# EAGLE design powerboard1_2 (EAGLE 8.1.1)
DRAWING_TITLE: POWER_BOARD; REVISION: 1.1
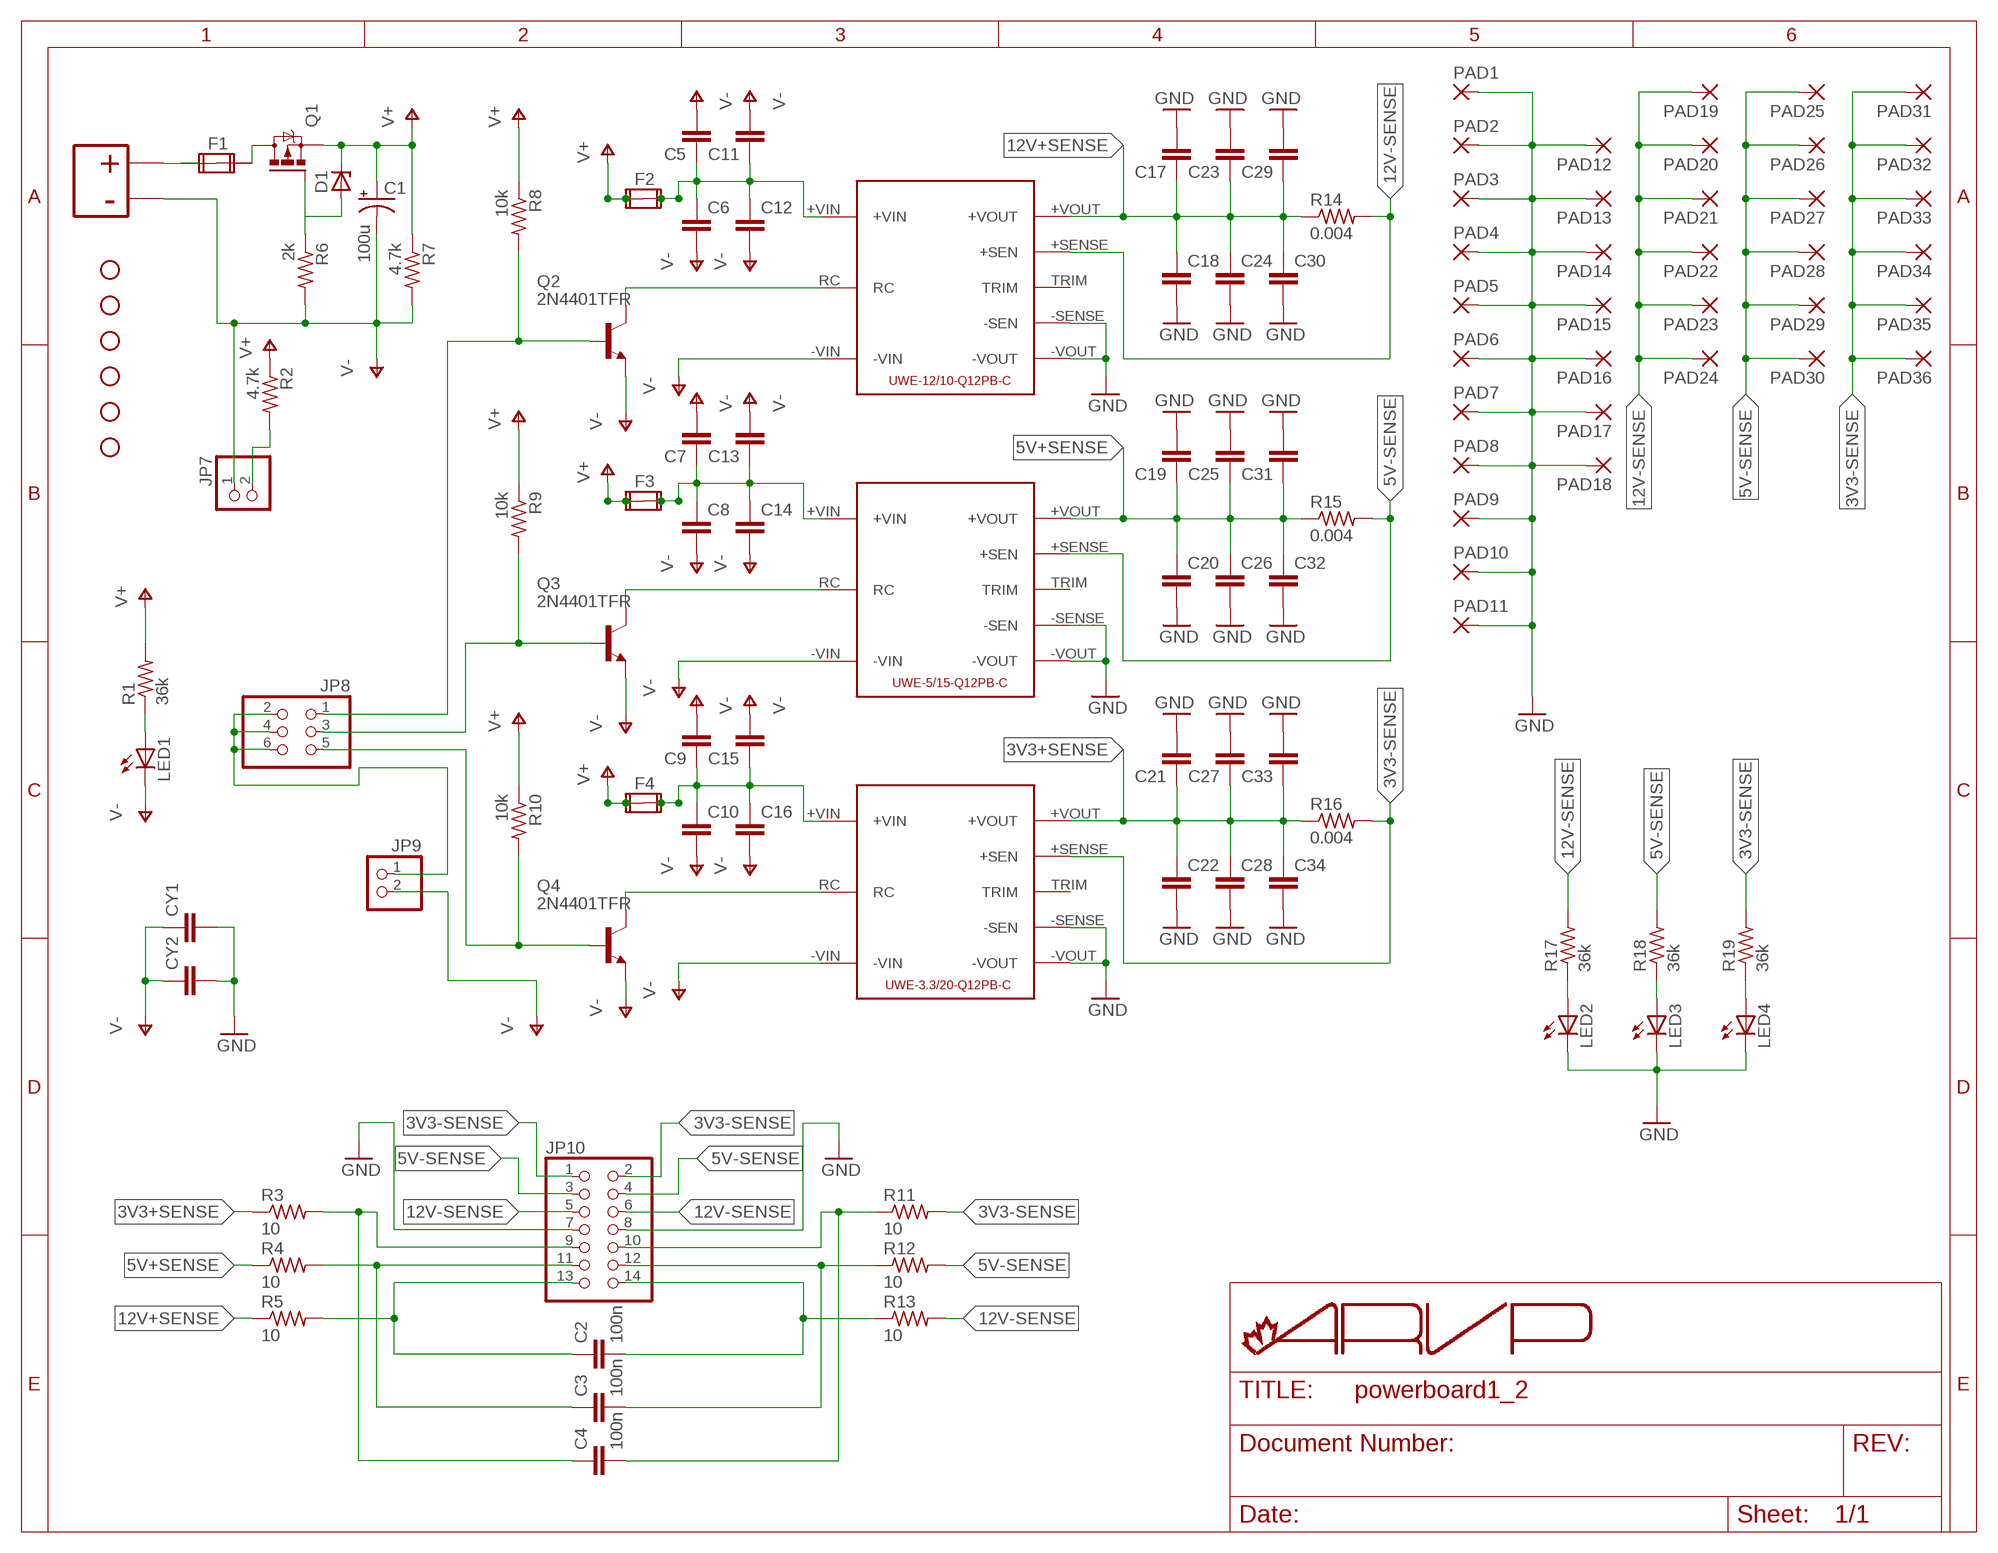
[diagram p0: schematic, sheet 1]

## Parts
C1  100u  CPOL-USE3.5-8  [E3,5-8]
C2  100n  C-EU025-024X044  [C025-024X044]
C3  100n  C-EU025-024X044  [C025-024X044]
C4  100n  C-EU025-024X044  [C025-024X044]
C5  C-EU050-035X075  [C050-035X075]
C6  C-EU050-035X075  [C050-035X075]
C7  C-EU050-035X075  [C050-035X075]
C8  C-EU050-035X075  [C050-035X075]
C9  C-EU050-035X075  [C050-035X075]
C10  C-EU050-035X075  [C050-035X075]
C11  C-EU050-035X075  [C050-035X075]
C12  C-EU050-035X075  [C050-035X075]
C13  C-EU050-035X075  [C050-035X075]
C14  C-EU050-035X075  [C050-035X075]
C15  C-EU050-035X075  [C050-035X075]
C16  C-EU050-035X075  [C050-035X075]
C17  C-EU025-040X050  [C025-040X050]
C18  C-EU025-040X050  [C025-040X050]
C19  C-EU025-040X050  [C025-040X050]
C20  C-EU025-040X050  [C025-040X050]
C21  C-EU025-040X050  [C025-040X050]
C22  C-EU025-040X050  [C025-040X050]
C23  C-EU025-040X050  [C025-040X050]
C24  C-EU025-040X050  [C025-040X050]
C25  C-EU025-040X050  [C025-040X050]
C26  C-EU025-040X050  [C025-040X050]
C27  C-EU025-040X050  [C025-040X050]
C28  C-EU025-040X050  [C025-040X050]
C29  C-EU025-040X050  [C025-040X050]
C30  C-EU025-040X050  [C025-040X050]
C31  C-EU025-040X050  [C025-040X050]
C32  C-EU025-040X050  [C025-040X050]
C33  C-EU025-040X050  [C025-040X050]
C34  C-EU025-040X050  [C025-040X050]
CY1  CYYC7B5  [YC7B5]
CY2  CYYC7B5  [YC7B5]
D1  BZV10  [DO34Z7]
F1  FUSE2P  [FUSE1]
F2  FUSE2P  [FUSE1]
F3  FUSE2P  [FUSE1]
F4  FUSE2P  [FUSE1]
JP1  STAND-OFF  [STAND-OFF]
JP2  STAND-OFF  [STAND-OFF]
JP3  STAND-OFF  [STAND-OFF]
JP4  STAND-OFF  [STAND-OFF]
JP5  STAND-OFF  [STAND-OFF]
JP6  STAND-OFF  [STAND-OFF]
JP7  PINHD-1X2/90  [1X02/90]
JP8  PINHD-2X3/90  [2X03/90]
JP9  PINHD-1X2/90  [1X02/90]
JP10  PINHD-2X7  [2X07]
LED1  LED3MM  [LED3MM]
LED2  LED3MM  [LED3MM]
LED3  LED3MM  [LED3MM]
LED4  LED3MM  [LED3MM]
PAD1  WIREPAD3,17/1,3  [3,17/1,3]
PAD2  WIREPAD3,17/1,3  [3,17/1,3]
PAD3  WIREPAD3,17/1,3  [3,17/1,3]
PAD4  WIREPAD3,17/1,3  [3,17/1,3]
PAD5  WIREPAD3,17/1,3  [3,17/1,3]
PAD6  WIREPAD3,17/1,3  [3,17/1,3]
PAD7  WIREPAD3,17/1,3  [3,17/1,3]
PAD8  WIREPAD3,17/1,3  [3,17/1,3]
PAD9  WIREPAD3,17/1,3  [3,17/1,3]
PAD10  WIREPAD3,17/1,3  [3,17/1,3]
PAD11  WIREPAD3,17/1,3  [3,17/1,3]
PAD12  WIREPAD3,17/1,3  [3,17/1,3]
PAD13  WIREPAD3,17/1,3  [3,17/1,3]
PAD14  WIREPAD3,17/1,3  [3,17/1,3]
PAD15  WIREPAD3,17/1,3  [3,17/1,3]
PAD16  WIREPAD3,17/1,3  [3,17/1,3]
PAD17  WIREPAD3,17/1,3  [3,17/1,3]
PAD18  WIREPAD3,17/1,3  [3,17/1,3]
PAD19  WIREPAD3,17/1,3  [3,17/1,3]
PAD20  WIREPAD3,17/1,3  [3,17/1,3]
PAD21  WIREPAD3,17/1,3  [3,17/1,3]
PAD22  WIREPAD3,17/1,3  [3,17/1,3]
PAD23  WIREPAD3,17/1,3  [3,17/1,3]
PAD24  WIREPAD3,17/1,3  [3,17/1,3]
PAD25  WIREPAD3,17/1,3  [3,17/1,3]
PAD26  WIREPAD3,17/1,3  [3,17/1,3]
PAD27  WIREPAD3,17/1,3  [3,17/1,3]
PAD28  WIREPAD3,17/1,3  [3,17/1,3]
PAD29  WIREPAD3,17/1,3  [3,17/1,3]
PAD30  WIREPAD3,17/1,3  [3,17/1,3]
PAD31  WIREPAD3,17/1,3  [3,17/1,3]
PAD32  WIREPAD3,17/1,3  [3,17/1,3]
PAD33  WIREPAD3,17/1,3  [3,17/1,3]
PAD34  WIREPAD3,17/1,3  [3,17/1,3]
PAD35  WIREPAD3,17/1,3  [3,17/1,3]
PAD36  WIREPAD3,17/1,3  [3,17/1,3]
Q1  IPP80P03P4L04AKSA1  [TO220BV]
Q2  2N4401TFR  [TO92-EBC]
Q3  2N4401TFR  [TO92-EBC]
Q4  2N4401TFR  [TO92-EBC]
R1  36k  R-US_0204/7  [0204/7]
R2  4.7k  R-US_0204/7  [0204/7]
R3  10  R-US_0204/5  [0204/5]
R4  10  R-US_0204/5  [0204/5]
R5  10  R-US_0204/5  [0204/5]
R6  2k  R-US_0204/7  [0204/7]
R7  4.7k  R-US_0204/7  [0204/7]
R8  10k  R-US_0204/7  [0204/7]
R9  10k  R-US_0204/7  [0204/7]
R10  10k  R-US_0204/7  [0204/7]
R11  10  R-US_0204/5  [0204/5]
R12  10  R-US_0204/5  [0204/5]
R13  10  R-US_0204/5  [0204/5]
R14  0.004  R-US_0617/22  [0617/22]
R15  0.004  R-US_0617/22  [0617/22]
R16  0.004  R-US_0617/22  [0617/22]
R17  36k  R-US_0204/7  [0204/7]
R18  36k  R-US_0204/7  [0204/7]
R19  36k  R-US_0204/7  [0204/7]
T1  2_POS_TERMINAL  [PHOENIX_CONTACT_MKDS_5/2-7.62]
U1  UWE-12/10-Q12PB-C  [UWE-100-120W]
U2  UWE-5/15-Q12PB-C  [UWE-100-120W]
U3  UWE-3.3/20-Q12PB-C  [UWE-100-120W]

## Nets
3V3+SENSE: C21.1 C22.1 C27.1 C28.1 C33.1 C34.1 R3.1 R16.1 U3.+VOUT
3V3-SENSE: JP10.1 JP10.2 PAD31.1(P) PAD32.1(P) PAD33.1(P) PAD34.1(P) PAD35.1(P) PAD36.1(P) R11.2 R16.2 R19.2 U3.+SENSE(+SEN)
5V+SENSE: C19.1 C20.1 C25.1 C26.1 C31.1 C32.1 R4.1 R15.1 U2.+VOUT
5V-SENSE: JP10.3 JP10.4 PAD25.1(P) PAD26.1(P) PAD27.1(P) PAD28.1(P) PAD29.1(P) PAD30.1(P) R12.2 R15.2 R18.2 U2.+SENSE(+SEN)
12V+SENSE: C17.1 C18.1 C23.1 C24.1 C29.1 C30.1 R5.1 R14.1 U1.+VOUT
12V-SENSE: JP10.5 JP10.6 PAD19.1(P) PAD20.1(P) PAD21.1(P) PAD22.1(P) PAD23.1(P) PAD24.1(P) R13.2 R14.2 R17.2 U1.+SENSE(+SEN)
ENABLE_3V3: Q4.C U3.RC
ENABLE_5V: Q3.C U2.RC
ENABLE_12V: Q2.C U1.RC
GND [ouputGroundPlane]: C17.2 C18.2 C19.2 C20.2 C21.2 C22.2 C23.2 C24.2 C25.2 C26.2 C27.2 C28.2 C29.2 C30.2 C31.2 C32.2 C33.2 C34.2 CY1.2 CY2.2 JP10.7 JP10.8 LED2.K(C) LED3.K(C) LED4.K(C) PAD1.1(P) PAD2.1(P) PAD3.1(P) PAD4.1(P) PAD5.1(P) PAD6.1(P) PAD7.1(P) PAD8.1(P) PAD9.1(P) PAD10.1(P) PAD11.1(P) PAD12.1(P) PAD13.1(P) PAD14.1(P) PAD15.1(P) PAD16.1(P) PAD17.1(P) PAD18.1(P) U1.-SENSE(-SEN) U1.-VOUT U2.-SENSE(-SEN) U2.-VOUT U3.-SENSE(-SEN) U3.-VOUT
J3: C4.1 JP10.9 R3.2
J4: C4.2 JP10.10 R11.1
J5: C3.1 JP10.11 R4.2
J6: C3.2 JP10.12 R12.1
J7: C2.1 JP10.13 R5.2
J8: C2.2 JP10.14 R13.1
N$1: LED1.A R1.1
N$2: JP7.2 R2.2
N$3: F1.1A F1.1B T1.P$1
N$4: D1.A Q1.G R6.1
N$5: C5.1 C6.1 C11.1 C12.1 F2.2A F2.2B U1.+VIN
N$7: C7.1 C8.1 C13.1 C14.1 F3.2A F3.2B U2.+VIN
N$8 [ouputGroundPlane]: JP8.2 JP8.4 JP8.6 JP9.1
N$9: LED2.A R17.1
N$10: LED3.A R18.1
N$11: LED4.A R19.1
N$12: C9.1 C10.1 C15.1 C16.1 F4.2A F4.2B U3.+VIN
ON/OFF_1 [inputGroundPlane]: JP8.1 Q2.B R8.2
ON/OFF_2 [inputGroundPlane]: JP8.3 Q3.B R9.2
ON/OFF_3 [inputGroundPlane]: JP8.5 Q4.B R10.2
V+: C1.+ D1.C F2.1A F2.1B F3.1A F3.1B F4.1A F4.1B Q1.S R1.2 R2.1 R7.1 R8.1 R9.1 R10.1
V- [ouputGroundPlane]: C1.- C5.2 C6.2 C7.2 C8.2 C9.2 C10.2 C11.2 C12.2 C13.2 C14.2 C15.2 C16.2 CY1.1 CY2.1 JP7.1 JP9.2 LED1.K(C) Q2.E Q3.E Q4.E R6.2 R7.2 T1.P$2 U1.-VIN U2.-VIN U3.-VIN
VBAT+: F1.2A F1.2B Q1.D
Unconnected: U1.TRIM U2.TRIM U3.TRIM

## Library data of the parts
C1 = rcl:CPOL-US: POLARIZED CAPACITOR, American symbol
C2-C34 = rcl:C-EU: CAPACITOR, European symbol
CY1 CY2 = rcl:CY: Y CAPACITOR for power line
D1 = diode:BZV10: Z DIODE
F1-F4 = special:FUSE2P: FUSE 5 x 20 mm
JP1-JP6 = SparkFun:STAND-OFF: Stand Off This is the mechanical footprint for a #4 phillips button head screw. Use the keepout ring to avoid running the screw head into surrounding components. SKU : PRT-00447
JP7 JP9 = pinhead:PINHD-1X2: PIN HEADER
JP8 = pinhead:PINHD-2X3: PIN HEADER
JP10 = pinhead:PINHD-2X7: PIN HEADER
LED1-LED4 = led:LED: LED OSRAM: - CHIPLED LG R971, LG N971, LY N971, LG Q971, LY Q971, LO R971, LY R971 LH N974, LH R974 LS Q976, LO Q976, LY Q976 LO Q996 - Hyper CHIPLED LW Q18S LB Q993, LB Q99A, LB R99A - SideLED LS A670, LO A670, LY A670, LG A670, LP A670 LB A673, LV A673, LT A673, LW A673 LH A674 LY A675 LS A676, LA A676, LO A676, LY A676, LW A676 LS A679, LY A679, LG A679 - Hyper Micro SIDELED® LS Y876, LA Y876, LO Y876, LY Y876 LT Y87S - SmartLED LW L88C, LW L88S LB L89C, LB L89S, LG L890 LS L89K, LO L89K, LY L89K LS L896, LA L896, LO L896, LY L896 - TOPLED LS T670, LO T670, LY T670, LG T670, LP T670 LSG T670, LSP T670, LSY T670, LOP T670, LYG T670 LG T671, LOG T671, LSG T671 LB T673, LV T673, LT T673, LW T673 LH T674 LS T676, LA T676, LO T676, LY T676, LB T676, LH T676, LSB T676, LW T676 LB T67C, LV T67C, LT T67C, LS T67K, LO T67K, LY T67K, LW E67C LS E67B, LA E67B, LO E67B, LY E67B, LB E67C, LV E67C, LT E67C LW T67C LS T679, LY T679, LG T679 LS T770, LO T770, LY T770, LG T770, LP T770 LB T773, LV T773, LT T773, LW T773 LH T774 LS E675, LA E675, LY E675, LS T675 LS T776, LA T776, LO T776, LY T776, LB T776 LHGB T686 LT T68C, LB T68C - Hyper Mini TOPLED® LB M676 - Mini TOPLED Santana® LG M470 LS M47K, LO M47K, LY M47K Source: http://www.osram.convergy.de LUXEON: - LUMILED® LXK2-PW12-R00, LXK2-PW12-S00, LXK2-PW14-U00, LXK2-PW14-V00 LXK2-PM12-R00, LXK2-PM12-S00, LXK2-PM14-U00 LXK2-PE12-Q00, LXK2-PE12-R00, LXK2-PE12-S00, LXK2-PE14-T00, LXK2-PE14-U00 LXK2-PB12-K00, LXK2-PB12-L00, LXK2-PB12-M00, LXK2-PB14-N00, LXK2-PB14-P00, LXK2-PB14-Q00 LXK2-PR12-L00, LXK2-PR12-M00, LXK2-PR14-Q00, LXK2-PR14-R00 LXK2-PD12-Q00, LXK2-PD12-R00, LXK2-PD12-S00 LXK2-PH12-R00, LXK2-PH12-S00 LXK2-PL12-P00, LXK2-PL12-Q00, LXK2-PL12-R00 Source: www.luxeon.com KINGBRIGHT: KA-3528ASYC Source: www.kingbright.com
PAD1-PAD36 = wirepad:WIREPAD: Wire PAD connect wire on PCB
Q1 = transistor-power:IPP80P03P4L04AKSA1: P-CHANNEL MOS-FET SYMBOL
Q2-Q4 = New Power Board Library:2N4401TFR: NPN Transistor
R1 R2 R6-R10 R17-R19 = resistor:R-US_: RESISTOR, American symbol
R3-R5 R11-R16 = rcl:R-US_: RESISTOR, American symbol
T1 = New Power Board Library:2_POS_TERMINAL
U1 = New Power Board Library:UWE-12/10-Q12PB-C
U2 = New Power Board Library:UWE-5/15-Q12PB-C
U3 = New Power Board Library:UWE-3.3/20-Q12PB-C

## Net classes
0 default: clearance 0.205 mm
1 ouputGroundPlane: clearance 0.205 mm to class 0, clearance 1 mm
2 inputGroundPlane: clearance 0.205 mm to class 1

## Board
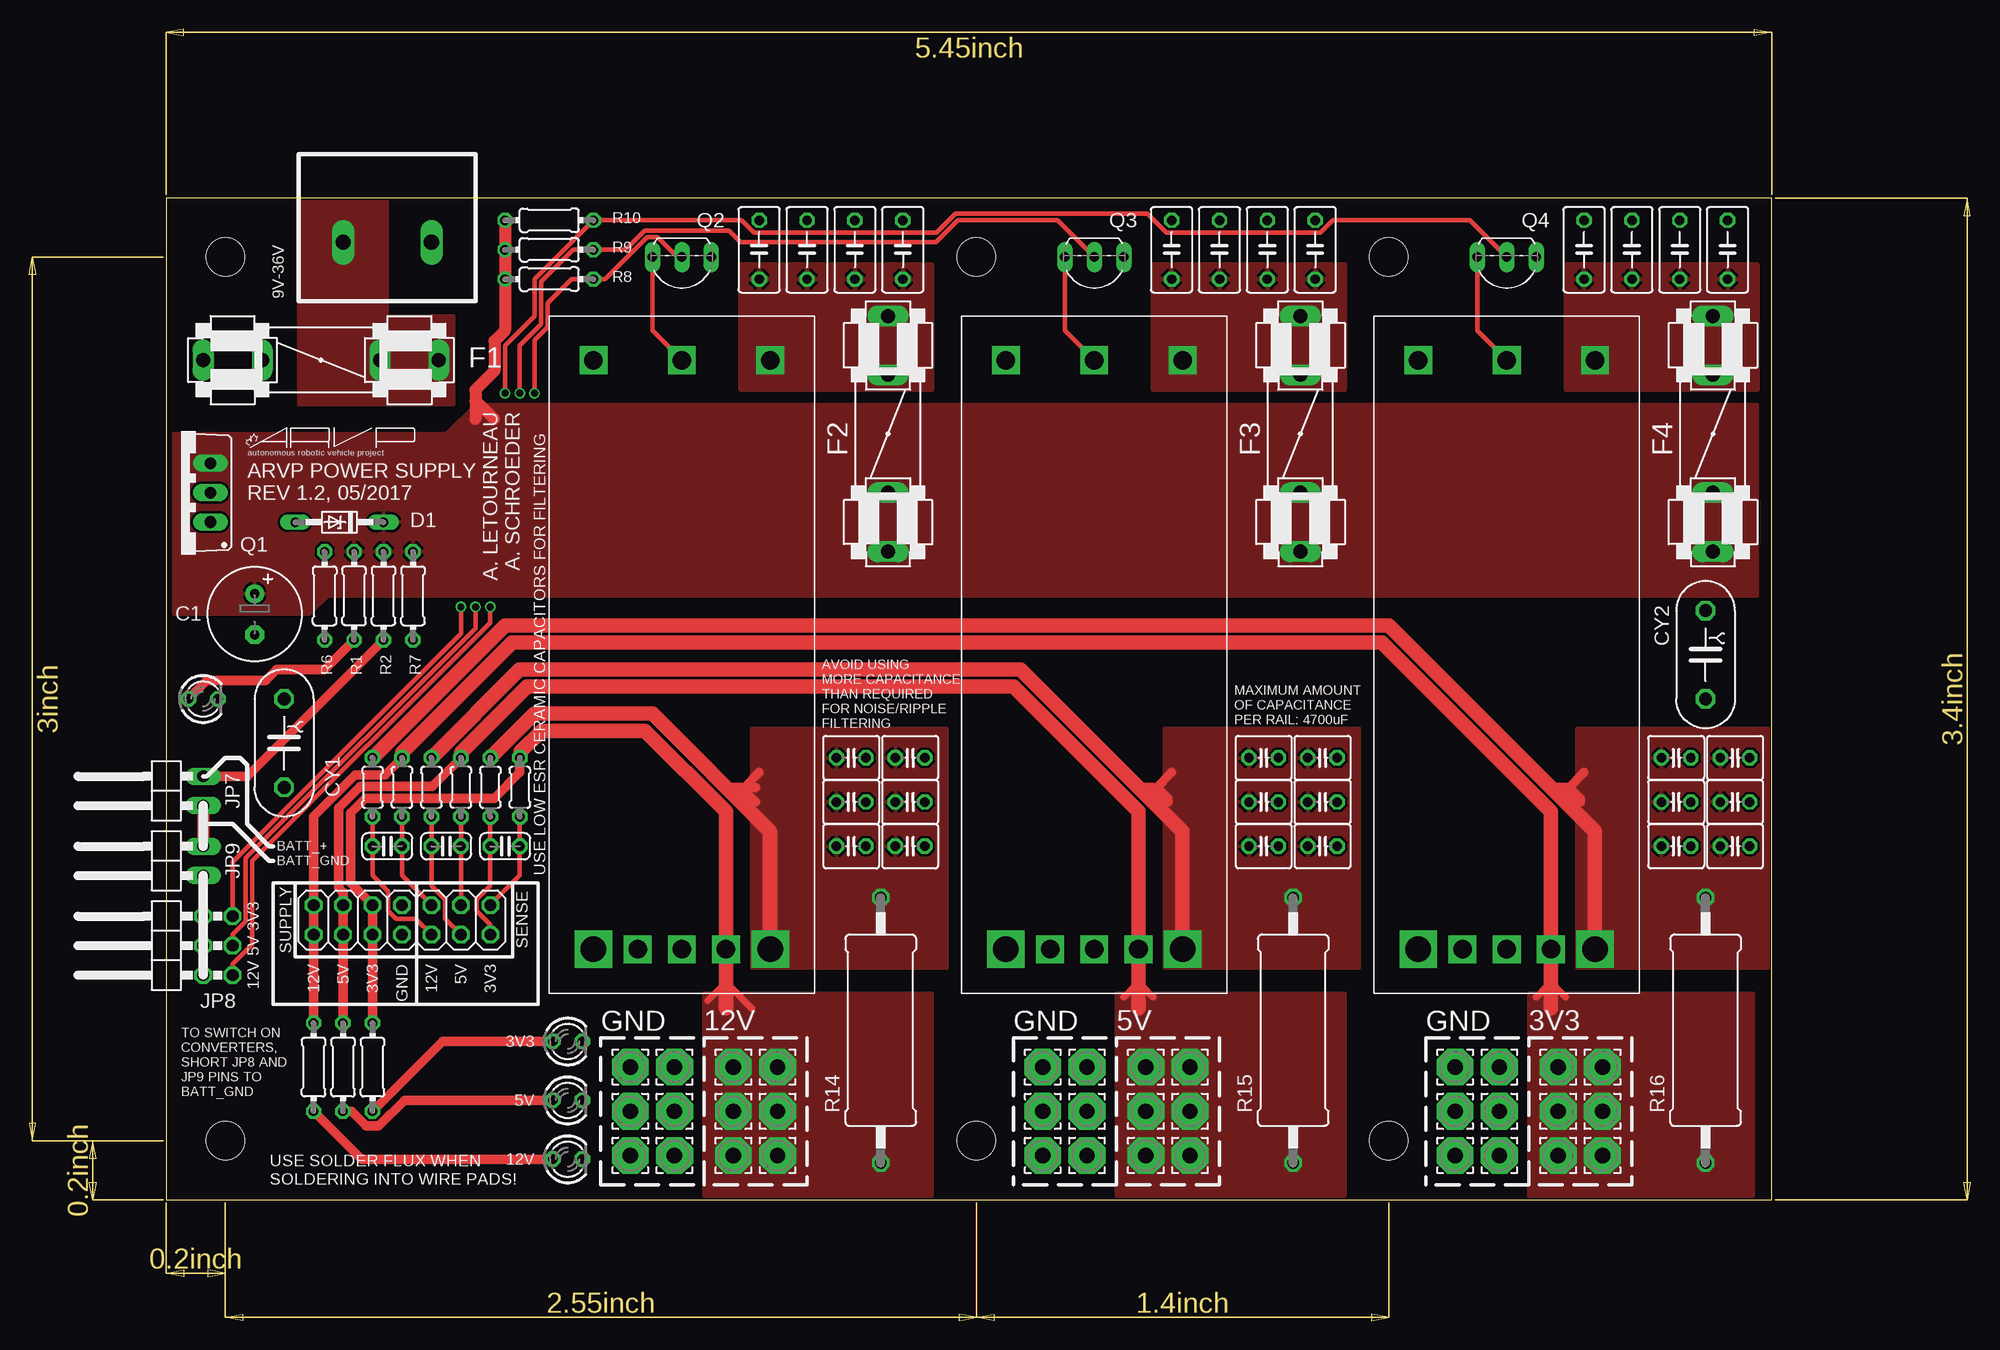
[diagram p1: board, top side]
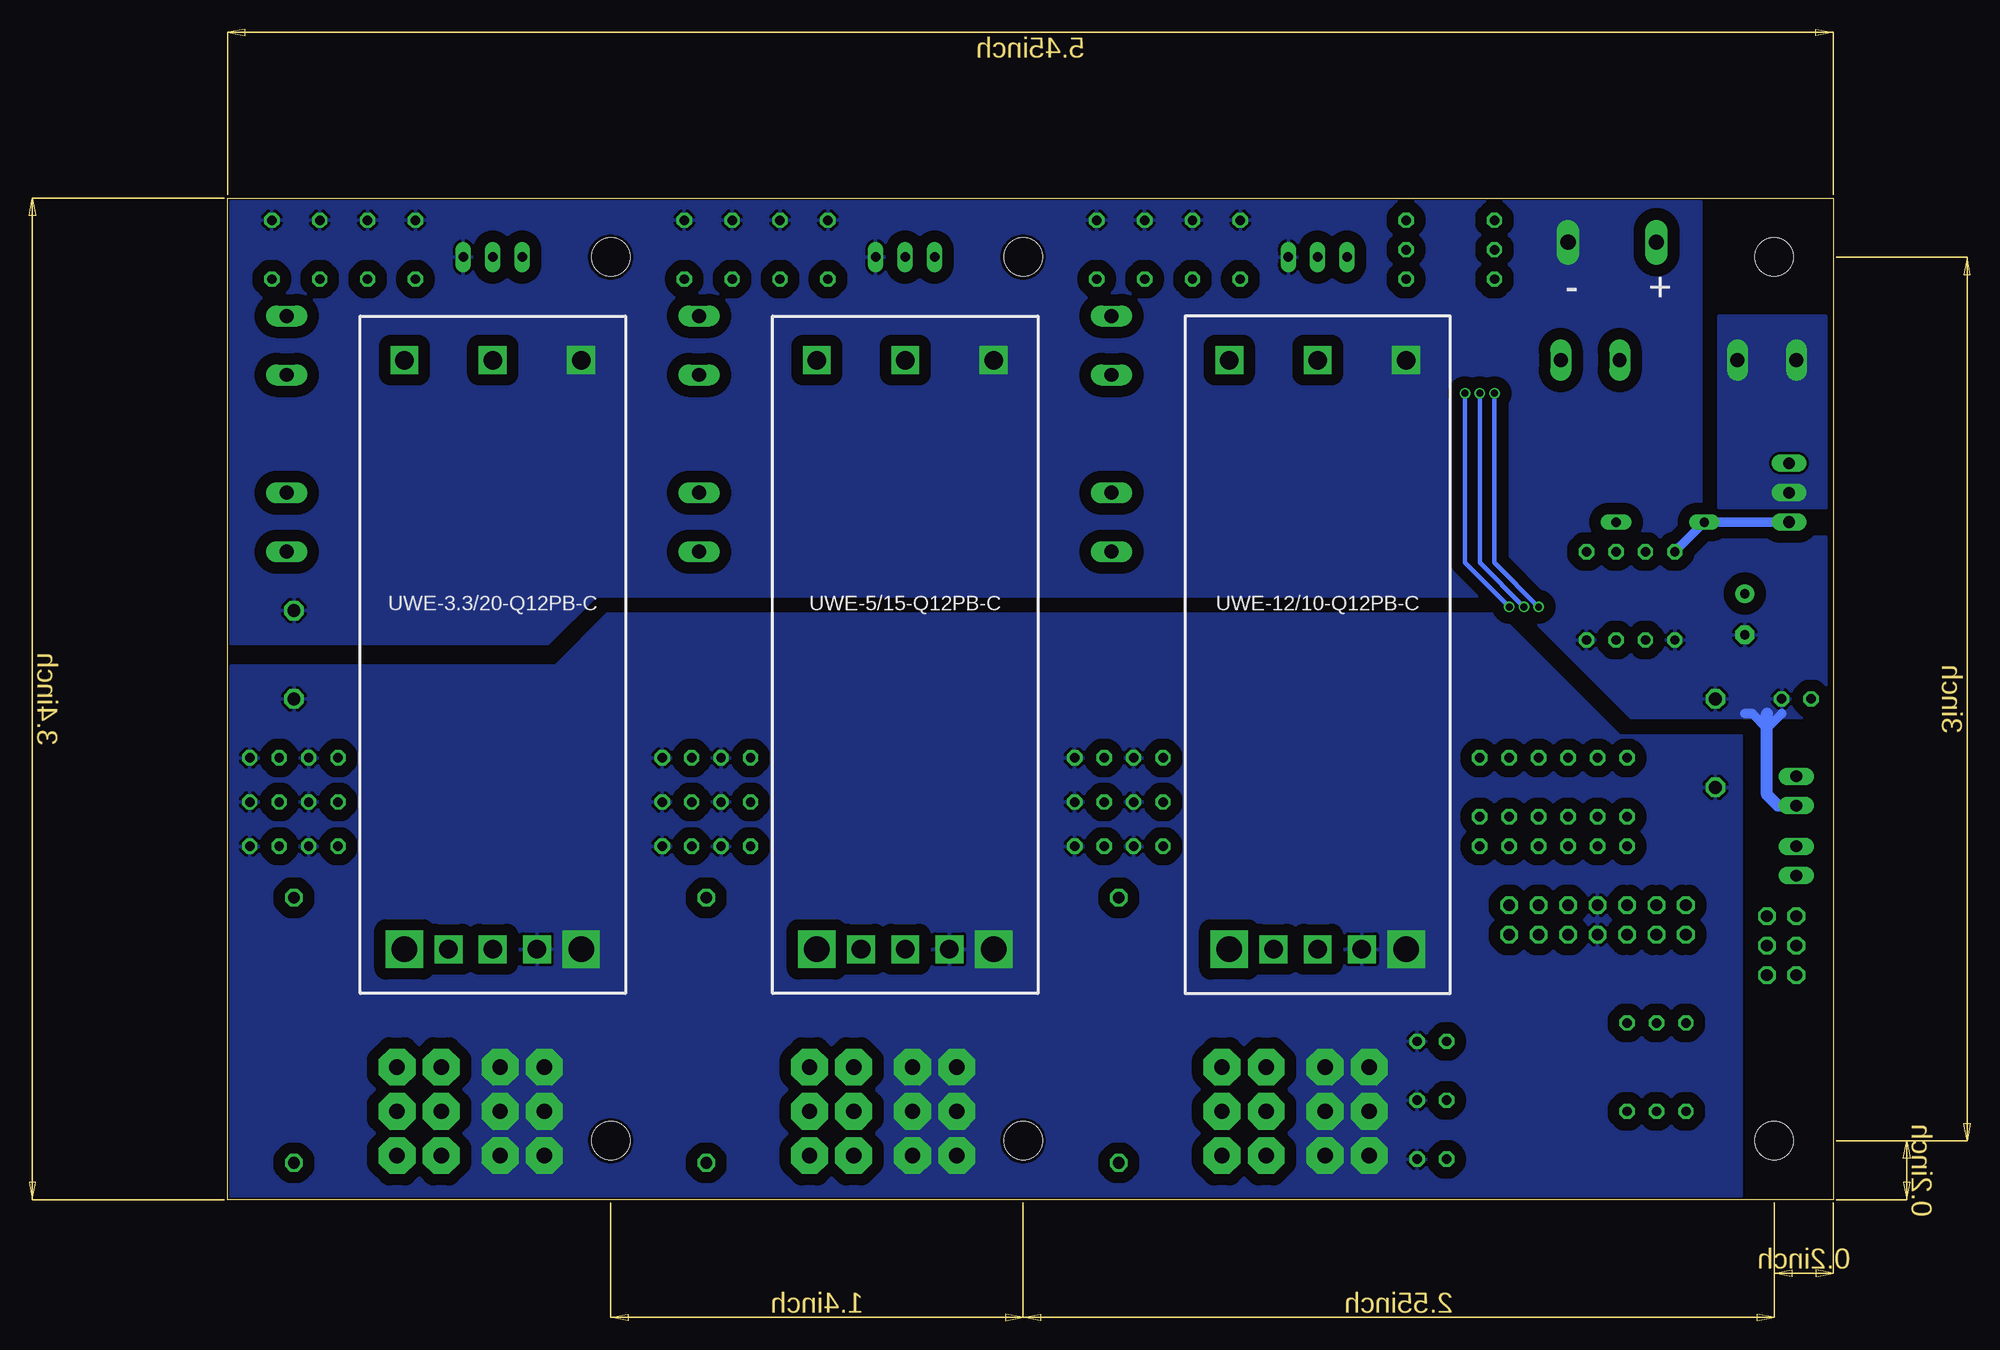
[diagram p2: board, bottom side, seen from below]

Size 167.39 x 111.41 mm. Coordinates in mm from the lower left corner, seen from the top.
Copper layers (1*16): Top 0.035mm / dielectric 1.5mm / Bottom 0.035mm
Design rules "ITEADstudioDRC": minimum track width 6mil, minimum drill 12mil, track to track 6mil, track to pad 6mil, pad to pad 6mil, via to via 6mil, smd to smd 0mil, copper to edge 10mil, drill to drill 10mil, minimum pad ring 10mil, minimum via ring 6mil, stop-mask expansion 2mil, vias tented up to drill 100mil, thermal gap 10mil
Milling: 4 lines

### Footprints (pad centres in the part's own frame; a part is rotated, then mirrored left to right if it is on the bottom)
E3,5-8 = drill 0.813 pad 1.6: + -1.778,0 | drill 0.813 pad 1.6 octagon: - 1.778,0
C025-024X044 = drill 0.813 octagon: 1 -1.27,0; 2 1.27,0
C050-035X075 = drill 0.813 octagon: 1 -2.54,0; 2 2.54,0
C025-040X050 = drill 0.813 octagon: 1 -1.27,0; 2 1.27,0
YC7B5 = drill 1.118 octagon: 1 -3.81,0; 2 3.81,0
DO34Z7 = drill 0.813 long: A 3.81,0; C -3.81,0
FUSE1 = drill 1.194 long: 1A -10.16,0; 1B -5.08,0; 2A 10.16,0; 2B 5.08,0
STAND-OFF = hole 3.302: 0,0
1X02/90 = drill 1.016 long: 1 -1.27,-3.81; 2 1.27,-3.81
2X03/90 = drill 1.016 octagon: 1 -2.54,-6.35; 2 -2.54,-3.81; 3 0,-6.35; 4 0,-3.81; 5 2.54,-6.35; 6 2.54,-3.81
2X07 = drill 1.016 octagon: 1 -7.62,-1.27; 2 -7.62,1.27; 3 -5.08,-1.27; 4 -5.08,1.27; 5 -2.54,-1.27; 6 -2.54,1.27; 7 0,-1.27; 8 0,1.27; 9 2.54,-1.27; 10 2.54,1.27; 11 5.08,-1.27; 12 5.08,1.27; 13 7.62,-1.27; 14 7.62,1.27
LED3MM = drill 0.813 octagon: A -1.27,0; K 1.27,0
3,17/1,3 = drill 1.321 pad 3.175 octagon: 1 0,0
TO220BV = drill 1.016 long: D 0,-2.54; G -2.54,-2.54; S 2.54,-2.54
TO92-EBC = drill 0.813 long: B 0,-1.27; C 2.54,-1.27; E -2.54,-1.27
0204/7 = drill 0.813 octagon: 1 -3.81,0; 2 3.81,0
0204/5 = drill 0.813 octagon: 1 -2.54,0; 2 2.54,0
0617/22 = drill 1.016 octagon: 1 -11.43,0; 2 11.43,0
PHOENIX_CONTACT_MKDS_5/2-7.62 = drill 1.3 long: P$1 3.81,0; P$2 -3.81,0
UWE-100-120W = drill 1.6 square: +SENSE 25.4,3.81; +VIN -25.4,7.62; -SENSE 25.4,-3.81; -VIN -25.4,-7.62; RC -25.4,0; TRIM 25.4,0 | drill 2.2 square: +VOUT 25.4,7.62; -VOUT 25.4,-7.62

### Placement (x,y rotation side)
C1  19.46,60.94 270 top
C2  41.05,40.94 0 top
C3  35.97,40.94 0 top
C4  30.89,40.94 0 top
C5  75.34,92.38 90 top
C6  62.95,92.38 90 top
C7  110.9,92.38 90 top
C8  98.51,92.38 90 top
C9  146.46,92.38 90 top
C10  134.07,92.38 90 top
C11  71.21,92.38 90 top
C12  67.08,92.38 90 top
C13  106.77,92.38 90 top
C14  102.64,92.38 90 top
C15  142.33,92.38 90 top
C16  138.2,92.38 90 top
C17  75.97,40.94 0 top
C18  70.89,48.56 0 top
C19  111.53,40.94 0 top
C20  106.45,44.75 0 top
C21  147.09,40.94 0 top
C22  142.01,48.56 0 top
C23  75.97,44.75 0 top
C24  70.89,44.75 0 top
C25  111.53,44.75 0 top
C26  106.45,48.56 0 top
C27  147.09,44.75 0 top
C28  142.01,44.75 0 top
C29  75.97,48.56 0 top
C30  70.89,40.94 0 top
C31  111.53,48.56 0 top
C32  106.45,40.94 0 top
C33  147.09,48.56 0 top
C34  142.01,40.94 0 top
CY1  22,49.83 270 top
CY2  144.55,57.45 270 top
D1  26.76,68.88 180 top
F1  25.17,82.85 180 top
F2  74.07,76.5 90 top
F3  109.63,76.5 90 top
F4  145.19,76.5 90 top
JP1  81.69,15.54 0 top
JP2  117.25,15.54 0 top
JP3  117.25,91.74 0 top
JP4  16.92,15.54 0 top
JP5  16.92,91.74 0 top
JP6  81.69,91.74 0 top
JP7  11.2,45.7 90 top
JP8  11.2,32.37 90 top
JP9  11.2,39.67 90 top
JP10  32.16,34.59 0 top
LED1  15.01,53.64 0 top
LED2  46.44,24.11 0 top
LED3  46.44,19.03 0 top
LED4  46.44,13.95 0 top
PAD1  51.84,14.27 0 top
PAD2  55.65,14.27 0 top
PAD3  51.84,18.08 0 top
PAD4  55.65,18.08 0 top
PAD5  51.84,21.89 0 top
PAD6  55.65,21.89 0 top
PAD7  126.77,14.27 90 top
PAD8  122.96,18.08 90 top
PAD9  122.96,21.89 90 top
PAD10  91.21,18.08 0 top
PAD11  91.21,21.89 0 top
PAD12  122.96,14.27 90 top
PAD13  87.4,21.89 0 top
PAD14  87.4,18.08 0 top
PAD15  87.4,14.27 0 top
PAD16  91.21,14.27 0 top
PAD17  126.77,21.89 90 top
PAD18  126.77,18.08 90 top
PAD19  60.73,21.89 0 top
PAD20  64.54,21.89 0 top
PAD21  64.54,14.27 0 top
PAD22  60.73,14.27 0 top
PAD23  64.54,18.08 0 top
PAD24  60.73,18.08 0 top
PAD25  100.1,14.27 0 top
PAD26  100.1,21.89 0 top
PAD27  96.29,21.89 0 top
PAD28  96.29,14.27 0 top
PAD29  100.1,18.08 0 top
PAD30  96.29,18.08 0 top
PAD31  135.66,21.89 0 top
PAD32  131.85,21.89 0 top
PAD33  135.66,14.27 0 top
PAD34  131.85,14.27 0 top
PAD35  135.66,18.08 0 top
PAD36  131.85,18.08 0 top
Q1  13.11,71.42 90 top
Q2  56.29,90.47 180 top
Q3  91.85,90.47 180 top
Q4  127.41,90.47 180 top
R1  28.03,62.53 90 top
R2  30.57,62.53 270 top
R3  29.62,46.02 270 top
R4  34.7,46.02 270 top
R5  39.78,46.02 270 top
R6  25.49,62.53 270 top
R7  33.11,62.53 270 top
R8  44.86,89.84 0 top
R9  44.86,92.38 0 top
R10  44.86,94.91 0 top
R11  32.16,46.02 90 top
R12  37.24,46.02 90 top
R13  42.32,46.02 90 top
R14  73.43,25.07 270 top
R15  108.99,25.07 270 top
R16  144.55,25.07 270 top
R17  29.62,21.89 90 top
R18  27.08,21.89 90 top
R19  24.54,21.89 90 top
T1  30.89,93.01 180 top
U1  56.29,57.45 270 top
U2  91.85,57.45 270 top
U3  127.41,57.45 270 top
U$1  [FRAME_A_L]  -55.47,-61.93 0 top  (outside the outline)
U$2  [DOCFIELD]  118.52,-61.93 0 top  (outside the outline)
U$3  [ARVP]  18.82,74.59 0 top

### Tracks (layer width: path | path; a pad name or v marks a point on that pad's centre or on a via)
3V3+SENSE
  Top 0.813: 134.07,47.29 132.81,46.02 133.76,45.07 133.76,44.75 132.49,46.02 131.22,46.02
  Top 1.27: U3.+VOUT 135.03,42.21 131.22,46.02 117.25,59.99 41.05,59.99 R3.1
  pour Top: 149.95,30.46 149.95,51.1 133.44,51.1 133.44,30.46
  pour Top (no thermals): 146.46,38.4 133.44,38.4 133.44,30.46 146.46,30.46
3V3-SENSE
  Top 0.61: 129.95,27.92 130.9,28.88 131.22,28.88 131.53,28.88 132.49,27.92
  Top 0.813: R11.2 30.7,47.1 28.14,47.1 24.54,43.5 JP10.2 JP10.1 R19.2
  Top 1.27: R11.2 32.16,49.01 41.66,58.52 116.64,58.52 131.22,43.93 U3.+SENSE 131.22,28.88 131.22,26.97
  pour Top (no thermals): 129.31,28.24 148.68,28.24 148.68,10.78 129.31,10.78
5V+SENSE
  Top 0.813: 98.52,47.29 97.25,46.02 98.2,45.07 98.2,44.75 96.93,46.02 95.66,46.02
  Top 1.27: U2.+VOUT 99.47,42.21 95.66,46.02 85.5,56.18 42.32,56.18 R4.1
  pour Top: 97.88,30.46 97.88,51.1 114.71,51.1 114.71,30.46
  pour Top (no thermals): 110.9,38.4 97.88,38.4 97.88,30.46 110.9,30.46
5V-SENSE
  Top 0.61: 94.39,27.92 95.34,28.88 95.66,28.88 95.97,28.88 96.93,27.92
  Top 0.813: R12.2 34.76,46.09 28.56,46.09 26.69,44.22 26.69,37.34 27.08,36.96 JP10.4 JP10.3 R18.2
  Top 1.27: R12.2 37.24,49.01 42.93,54.7 84.89,54.7 95.66,43.93 U2.+SENSE 95.66,28.88 95.66,26.97
  pour Top (no thermals): 113.44,28.24 93.75,28.24 93.75,10.78 113.44,10.78
12V+SENSE
  Top 0.813: 61.69,46.02 61.37,46.02 | 61.69,46.02 62.96,47.29 | 60.1,46.02 61.37,46.02 | 61.37,46.02 62.64,44.75 | 61.69,46.02 62.64,46.02
  Top 1.27: U1.+VOUT 63.91,42.21 53.75,52.37 43.59,52.37 R5.1
  pour Top: 62.32,30.46 62.32,51.1 79.15,51.1 79.15,30.46
  pour Top (no thermals): 62.32,39.35 77.56,39.35 77.56,30.46 62.32,30.46
12V-SENSE
  Top 0.61: 62.32,26.97 60.41,28.88 60.1,28.88 59.78,28.88 58.51,27.61
  Top 0.813: R13.2 42.32,47.29 40.1,45.07 28.98,45.07 27.71,43.8 27.71,37.77 JP10.6 JP10.5 R17.2
  Top 1.27: R13.2 42.41,48.65 42.41,49.11 44.2,50.9 53.14,50.9 60.1,43.93 U1.+SENSE 60.1,28.88 60.1,26.97
  pour Top (no thermals): 77.88,28.24 58.19,28.24 58.19,10.78 77.88,10.78
ENABLE_3V3
  Top 0.406: Q4.C 124.87,85.39 U3.RC
ENABLE_5V
  Top 0.406: Q3.C 89.31,85.39 U2.RC
ENABLE_12V
  Top 0.406: Q2.C 53.75,85.39 U1.RC
GND
  pour Bottom: 149.95,56.5 149.95,10.78 19.77,10.78 19.77,50.47 30.25,50.47 40.73,60.94 117.56,60.94 122.01,56.5
  pour Bottom (no thermals): 46.76,34.59 46.76,29.51 50.57,29.51 50.57,34.59
  pour Bottom (no thermals): 81.69,34.59 81.69,29.51 86.45,29.51 86.45,34.59
  pour Bottom (no thermals): 117.25,34.59 117.25,29.51 122.01,29.51 122.01,34.59
  pour Bottom (no thermals): 58.19,24.43 49.3,24.43 49.3,11.73 58.19,11.73
  pour Bottom (no thermals): 93.75,24.43 84.86,24.43 84.86,11.73 93.75,11.73
  pour Bottom (no thermals): 129.31,24.43 120.42,24.43 120.42,11.73 129.31,11.73
J3
  Top 0.406: R3.2 C4.1 29.62,38.4 30.99,37.03 30.99,35.38 31.67,34.69 33.33,34.69 JP10.9
J4
  Top 0.406: R11.1 C4.2 32.16,38.4 JP10.10
J5
  Top 0.406: R4.2 C3.1 34.7,37.52 35.87,36.34 35.87,34.69 JP10.11
J6
  Top 0.406: R12.1 C3.2 JP10.12
J7
  Top 0.406: R5.2 C2.1 39.78,37.52 38.61,36.34 38.61,35.38 39.78,34.2 JP10.13
J8
  Top 0.406: R13.1 C2.2 42.32,38.4 JP10.14
N$1
  Top 0.813: R1.1 25.49,56.18 21.36,56.18 20.41,55.23 17.03,55.23 15.44,55.23 15.33,55.23 LED1.A
N$2
  Top 0.813: R2.2 18.82,46.97 JP7.2
N$3
  pour Top (no thermals): 30.89,96.5 23.27,96.5 23.27,79.04 36.6,79.04 36.6,86.66 30.89,86.66
N$4
  Bottom 0.813: R6.1 D1.A Q1.G
N$5
  pour Top: 77.88,80.31 77.88,91.1 61.37,91.1 61.37,80.31
  pour Top (no thermals): 61.37,80.31 76.61,80.31 76.61,87.93 61.37,87.93
N$7
  pour Top: 113.44,91.1 96.93,91.1 96.93,80.31 113.44,80.31
  pour Top (no thermals): 112.17,87.93 96.93,87.93 96.93,80.31 112.17,80.31
N$8
  Top 0.813: JP9.1 JP8.6 JP8.4 JP8.2
N$9
  Top 0.813: R17.1 35.65,24.11 LED2.A
N$10
  Top 0.813: R18.1 27.82,18.08 29.09,16.81 30.14,16.81 32.37,19.03 LED3.A
N$11
  Top 0.813: R19.1 28.67,13.95 LED4.A
N$12
  pour Top: 149,91.1 132.49,91.1 132.49,80.31 149,80.31
  pour Top (no thermals): 132.49,80.31 147.73,80.31 147.73,87.93 132.49,87.93
ON/OFF_1  (via drill 0.6)
  Top 0.406: 29.17,49.63 29.21,49.63 | 29.21,49.63 39.78,60.2 v39.78,61.58 | v43.59,79.99 43.59,84.6 44.71,85.72 44.71,87.78 46.76,89.84 R8.2 49.67,89.84 53.3,93.47 54.19,93.47 55.92,91.74 Q2.B | 29.21,49.63 29.17,49.63 | JP8.1 17.55,30.79 19.23,32.46 19.23,39.68 29.17,49.63
  Bottom 0.406: v43.59,79.99 43.59,65.39 v39.78,61.58
ON/OFF_2  (via drill 0.6)
  Top 0.406: v38.51,61.58 38.51,59.72 28.98,50.19 28.94,50.19 18.67,39.91 18.67,34.45 17.55,33.33 JP8.3 | v42.32,79.99 42.32,84.12 44.15,85.95 44.15,89.6 46.92,92.38 R9.2 51.42,92.38 53.07,94.03 60.35,94.03 61.37,93.01 78.19,93.01 80.1,94.91 88.67,94.91 Q3.B
  Bottom 0.406: v38.51,61.58 42.32,65.39 v42.32,79.99
ON/OFF_3  (via drill 0.6)
  Top 0.406: v37.24,61.58 37.24,59.27 17.55,39.59 JP8.5 | v41.05,79.99 41.05,84.12 43.59,86.66 43.59,89.84 R10.2 61.44,94.91 62.51,93.85 78.24,93.85 79.87,95.47 96.44,95.47 98.07,93.85 111.34,93.85 112.41,94.91 124.23,94.91 Q4.B
  Bottom 0.406: v41.05,79.99 41.05,65.39 v37.24,61.58
V+
  Top 1.016: R10.1 R9.1 R8.1 41.05,85.42 40.13,84.5 40.13,81.93 38.51,80.31 38.51,79.36 | 38.51,79.36 38.51,77.77 | 38.51,79.36 40.1,77.77
  pour Top: 149,62.53 25.81,62.53 24.22,60.94 12.47,60.94 12.47,76.5 35.97,76.5 38.51,79.04 149,79.04
  pour Top (no thermals): 70.26,72.69 70.26,62.53 149,62.53 149,72.69
  pour Top (no thermals): 12.47,76.5 12.47,70.15 23.27,70.15 23.27,76.5
V-
  Top 1.016: JP7.1 JP9.2
  Bottom 0.813: 19.46,52.37 18.82,52.37 17.55,51.1 16.28,52.37
  Bottom 1.016: JP7.1 16.6,44.43 17.55,45.39 17.55,52.37
  pour Bottom: 23.27,96.5 149.95,96.5 149.95,58.4 122.64,58.4 118.52,62.53 39.78,62.53 29.3,52.05 12.47,52.05 12.47,67.61 23.27,67.61
  pour Bottom (no thermals): 117.25,85.39 117.25,80.31 122.33,80.31 122.33,85.39
  pour Bottom (no thermals): 81.69,85.39 81.69,80.31 86.77,80.31 86.77,85.39
  pour Bottom (no thermals): 51.21,85.39 51.21,80.31 46.13,80.31 46.13,85.39
  pour Bottom (no thermals): 32.16,96.5 37.24,96.5 37.24,89.2 32.16,89.2
VBAT+
  pour Bottom (no thermals): 12.47,86.66 12.47,70.15 21.68,70.15 21.68,86.66

### Text on the board
tNames: 9V-36V | A. LETOURNEAU | A. SCHROEDER | ARVP POWER SUPPLY | REV 1.2, 05/2017 | AVOID USING | MORE CAPACITANCE | MAXIMUM AMOUNT | THAN REQUIRED | FOR NOISE/RIPPLE | OF CAPACITANCE | FILTERING | PER RAIL: 4700uF | BATT_+ | BATT_GND | USE LOW ESR CERAMIC CAPACITORS FOR FILTERING | 3V3 | SUPPLY | SENSE | 5V | 12V | 5V | 3V3 | GND | 12V | 5V | 3V3 | 12V | GND | 12V | GND | 5V | GND | 3V3 | TO SWITCH ON | 3V3 | CONVERTERS, | SHORT JP8 AND | JP9 PINS TO | BATT_GND | 5V | 12V | USE SOLDER FLUX WHEN | SOLDERING INTO WIRE PADS!
bNames: + | - | UWE-12/10-Q12PB-C | UWE-5/15-Q12PB-C | UWE-3.3/20-Q12PB-C